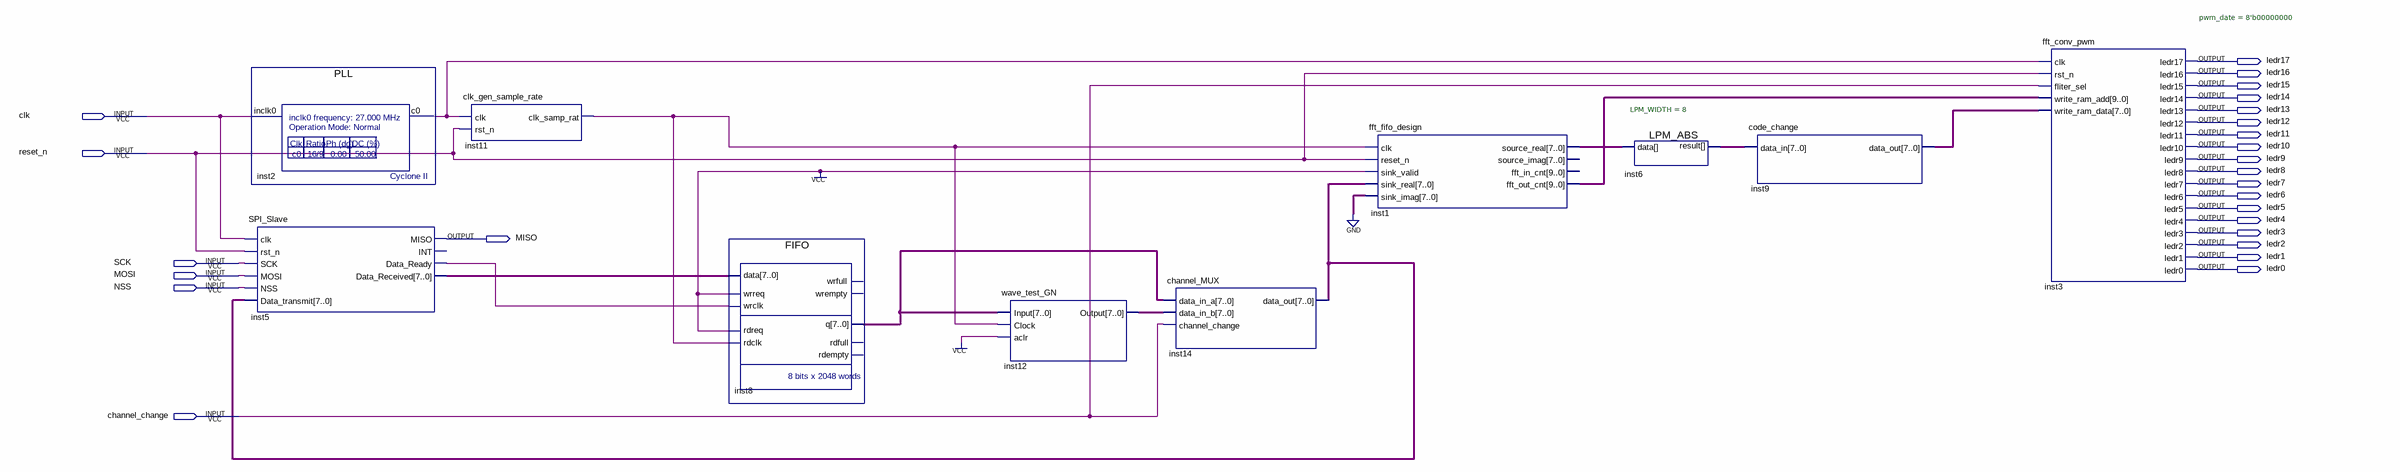
[diagram p0: schematic sheet]
// Quartus schematic fft_t.bdf as structural Verilog: 10 symbols, 25 pins
module fft_t (
  input  clk,
  input  reset_n,
  input  SCK,
  input  MOSI,
  input  NSS,
  input  channel_change,
  output ledr17,
  output ledr16,
  output ledr15,
  output ledr14,
  output ledr13,
  output ledr12,
  output ledr11,
  output ledr10,
  output ledr9,
  output ledr8,
  output ledr7,
  output ledr6,
  output ledr5,
  output ledr4,
  output ledr3,
  output MISO,
  output ledr2,
  output ledr1,
  output ledr0
);

  wire inst2_c0, inst5_data_ready, inst11_clk_samp_rat;
  wire [7:0] inst1_source_real, inst5_data_received, inst6_result, inst8_q, inst9_data_out, inst12_output,
       inst14_data_out;
  wire [9:0] inst1_fft_out_cnt;

  SPI_Slave inst5 (
    .clk(clk), .rst_n(reset_n), .SCK(SCK), .MOSI(MOSI), .NSS(NSS), .Data_transmit(inst14_data_out),
    .MISO(MISO), .Data_Ready(inst5_data_ready), .Data_Received(inst5_data_received));  // open: INT
  PLL inst2 (.inclk0(clk), .c0(inst2_c0));
  clk_gen_sample_rate inst11 (.clk(inst2_c0), .rst_n(reset_n), .clk_samp_rat(inst11_clk_samp_rat));
  FIFO inst8 (
    .data(inst5_data_received), .wrreq(1'b1), .wrclk(inst5_data_ready), .rdreq(1'b1),
    .rdclk(inst11_clk_samp_rat), .q(inst8_q));  // open: wrfull, wrempty, rdfull, rdempty
  wave_test_GN inst12 (.Input(inst8_q), .Clock(inst11_clk_samp_rat), .aclr(1'b1), .Output(inst12_output));
  channel_MUX inst14 (
    .data_in_a(inst8_q), .data_in_b(inst12_output), .channel_change(channel_change),
    .data_out(inst14_data_out));
  fft_fifo_design inst1 (
    .clk(inst11_clk_samp_rat), .reset_n(reset_n), .sink_valid(1'b1), .sink_real(inst14_data_out),
    .sink_imag({8{1'b0}}), .source_real(inst1_source_real), .fft_out_cnt(inst1_fft_out_cnt));  // open: source_imag, fft_in_cnt
  LPM_ABS #(.LPM_WIDTH(8)) inst6 (.data(inst1_source_real), .result(inst6_result));
  code_change inst9 (.data_in(inst6_result), .data_out(inst9_data_out));
  fft_conv_pwm #(.pwm_date(8'b00000000)) inst3 (
    .clk(inst2_c0), .rst_n(reset_n), .fliter_sel(channel_change), .write_ram_add(inst1_fft_out_cnt),
    .write_ram_data(inst9_data_out), .ledr17(ledr17), .ledr16(ledr16), .ledr15(ledr15), .ledr14(ledr14),
    .ledr13(ledr13), .ledr12(ledr12), .ledr11(ledr11), .ledr10(ledr10), .ledr9(ledr9), .ledr8(ledr8),
    .ledr7(ledr7), .ledr6(ledr6), .ledr5(ledr5), .ledr4(ledr4), .ledr3(ledr3), .ledr2(ledr2), .ledr1(ledr1),
    .ledr0(ledr0));
endmodule
